# EAGLE design aaa_ME433_Beir_HW2 (EAGLE 5.12)
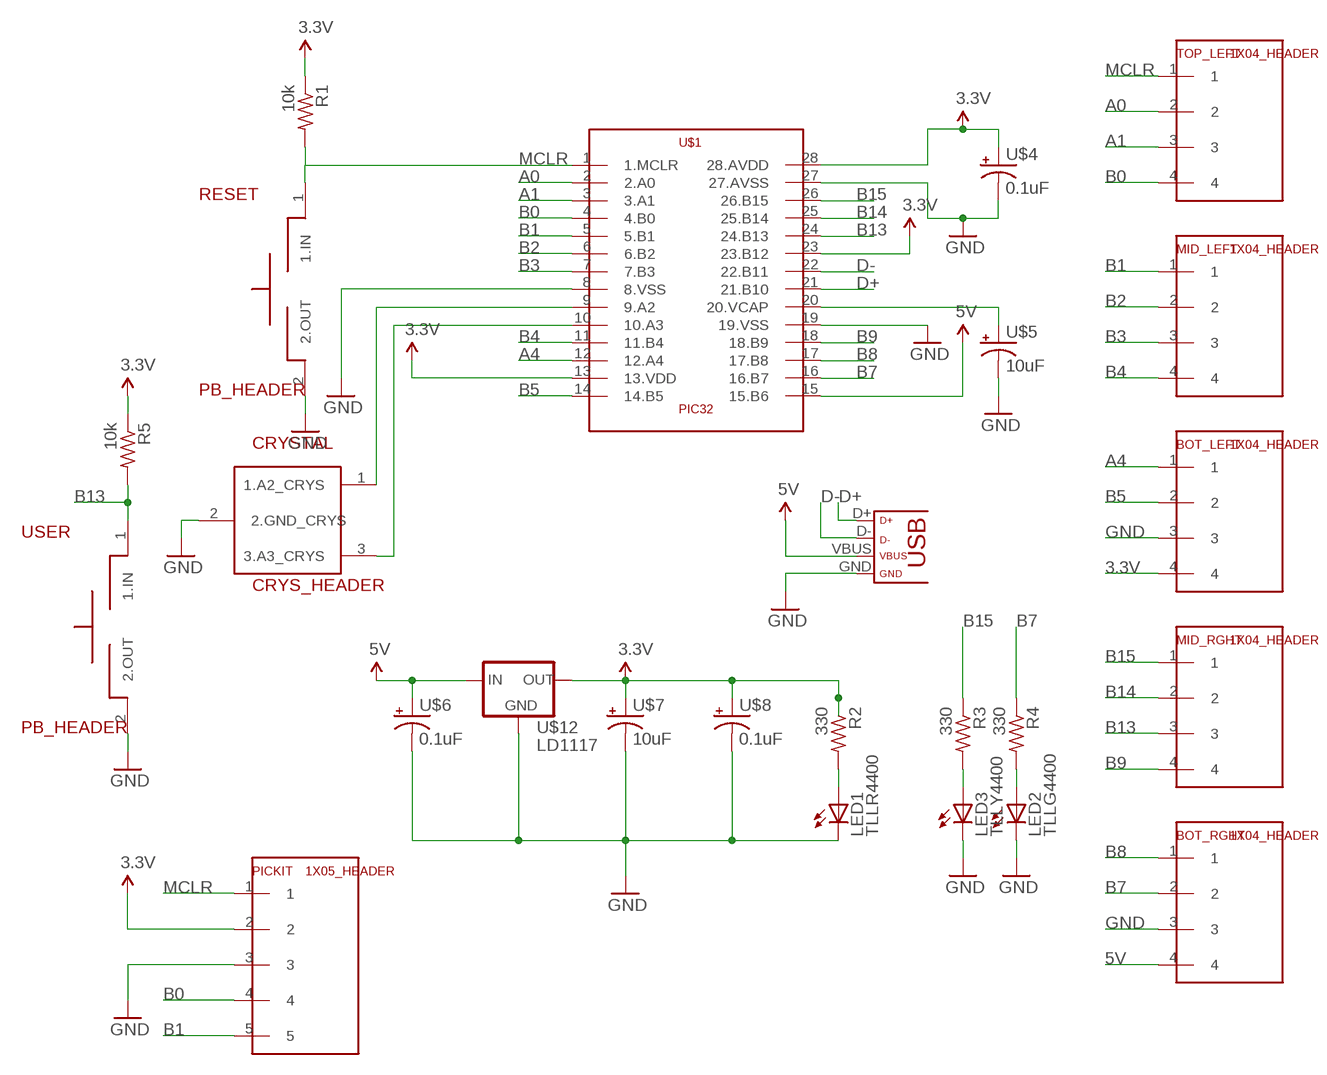
[diagram p0: schematic, sheet 1]

## Parts
BOT_LEFT  1X04_HEADER  [1X04]
BOT_RGHT  1X04_HEADER  [1X04]
CRYSTAL  CRYS_HEADER  [1X03]
LED1  TLLR4400  [LED3MM]
LED2  TLLG4400  [LED3MM]
LED3  TLLY4400  [LED3MM]
MID_LEFT  1X04_HEADER  [1X04]
MID_RGHT  1X04_HEADER  [1X04]
PICKIT  1X05_HEADER  [1X05]
R1  10k  R-US_0309/12  [0309/12]
R2  330  R-US_0309/12  [0309/12]
R3  330  R-US_0309/12  [0309/12]
R4  330  R-US_0309/12  [0309/12]
R5  10k  R-US_0309/12  [0309/12]
RESET  PB_HEADER  [1X02]
TOP_LEFT  1X04_HEADER  [1X04]
U$1  PIC32  [DIL28-3]
U$4  0.1uF  CAP_POL  [CAP_POL_D]
U$5  10uF  CAP_POL  [CAP_POL_D]
U$6  0.1uF  CAP_POL  [CAP_POL_D]
U$7  10uF  CAP_POL  [CAP_POL_D]
U$8  0.1uF  CAP_POL  [CAP_POL_D]
U$12  LD1117  [TO220]
U$13  USB  [USB-MINIB]
USER  PB_HEADER  [1X02]

## Nets
3.3V: BOT_LEFT.4 PICKIT.2 R1.1 R2.1 R5.1 U$1.13(13.VDD) U$1.23(23.B12) U$1.28(28.AVDD) U$4.1(+) U$7.1(+) U$8.1(+) U$12.2(OUT)
5V: BOT_RGHT.4 U$1.15(15.B6) U$6.1(+) U$12.3(IN) U$13.VBUS
A0: TOP_LEFT.2 U$1.2(2.A0)
A1: TOP_LEFT.3 U$1.3(3.A1)
A4: BOT_LEFT.1 U$1.12(12.A4)
B0: PICKIT.4 TOP_LEFT.4 U$1.4(4.B0)
B1: MID_LEFT.1 PICKIT.5 U$1.5(5.B1)
B2: MID_LEFT.2 U$1.6(6.B2)
B3: MID_LEFT.3 U$1.7(7.B3)
B4: MID_LEFT.4 U$1.11(11.B4)
B5: BOT_LEFT.2 U$1.14(14.B5)
B7: BOT_RGHT.2 R4.1 U$1.16(16.B7)
B8: BOT_RGHT.1 U$1.17(17.B8)
B9: MID_RGHT.4 U$1.18(18.B9)
B13: MID_RGHT.3 R5.2 U$1.24(24.B13) USER.1(1.IN)
B14: MID_RGHT.2 U$1.25(25.B14)
B15: MID_RGHT.1 R3.1 U$1.26(26.B15)
D+: U$1.21(21.B10) U$13.D+
D-: U$1.22(22.B11) U$13.D-
GND: BOT_LEFT.3 BOT_RGHT.3 CRYSTAL.2(2.GND_CRYS) LED1.K(C) LED2.K(C) LED3.K(C) PICKIT.3 RESET.2(2.OUT) U$1.8(8.VSS) U$1.19(19.VSS) U$1.27(27.AVSS) U$4.2(-) U$5.2(-) U$6.2(-) U$7.2(-) U$8.2(-) U$12.1(GND) U$13.GND USER.2(2.OUT)
MCLR: PICKIT.1 R1.2 RESET.1(1.IN) TOP_LEFT.1 U$1.1(1.MCLR)
N$2: CRYSTAL.3(3.A3_CRYS) U$1.10(10.A3)
N$3: CRYSTAL.1(1.A2_CRYS) U$1.9(9.A2)
N$4: U$1.20(20.VCAP) U$5.1(+)
N$6: LED1.A R2.2
N$32: LED3.A R3.2
N$33: LED2.A R4.2

## Library data of the parts
BOT_LEFT BOT_RGHT MID_LEFT MID_RGHT TOP_LEFT = ME433:1X04_HEADER
CRYSTAL = aaa_ME433_Beir_HW2:CRYS_HEADER
LED1 = aaa_ME433_Beir_HW2:TLLR4400: Low Current (2mA) LED 3 mm Tinted Diffused Package color RED Source: Data sheet <http://www.farnell.com/datasheets/391100.pdf>; MF: VISHAY SEMICONDUCTOR; OC_FARNELL: 1612437
LED2 = aaa_ME433_Beir_HW2:TLLG4400: Low Current (2mA) LED 3 mm Tinted Diffused Package color GREEN Source: Data sheet <http://www.farnell.com/datasheets/391098.pdf>; MF: VISHAY SEMICONDUCTOR; OC_FARNELL: 1612435
LED3 = aaa_ME433_Beir_HW2:TLLY4400: Low Current (2mA) LED 3 mm Tinted Diffused Package color YELLOW Source: Data sheet <http://www.farnell.com/datasheets/391098.pdf>; MF: VISHAY SEMICONDUCTOR; OC_FARNELL: 1612439
PICKIT = ME433:1X05_HEADER
R1-R5 = resistor:R-US_: RESISTOR, American symbol
RESET USER = aaa_ME433_Beir_HW2:PB_HEADER
U$1 = aaa_ME433_Beir_HW2:PIC32
U$4-U$8 = ME433:CAP_POL
U$12 = ME433:LD1117
U$13 = ME433:USB

## Board
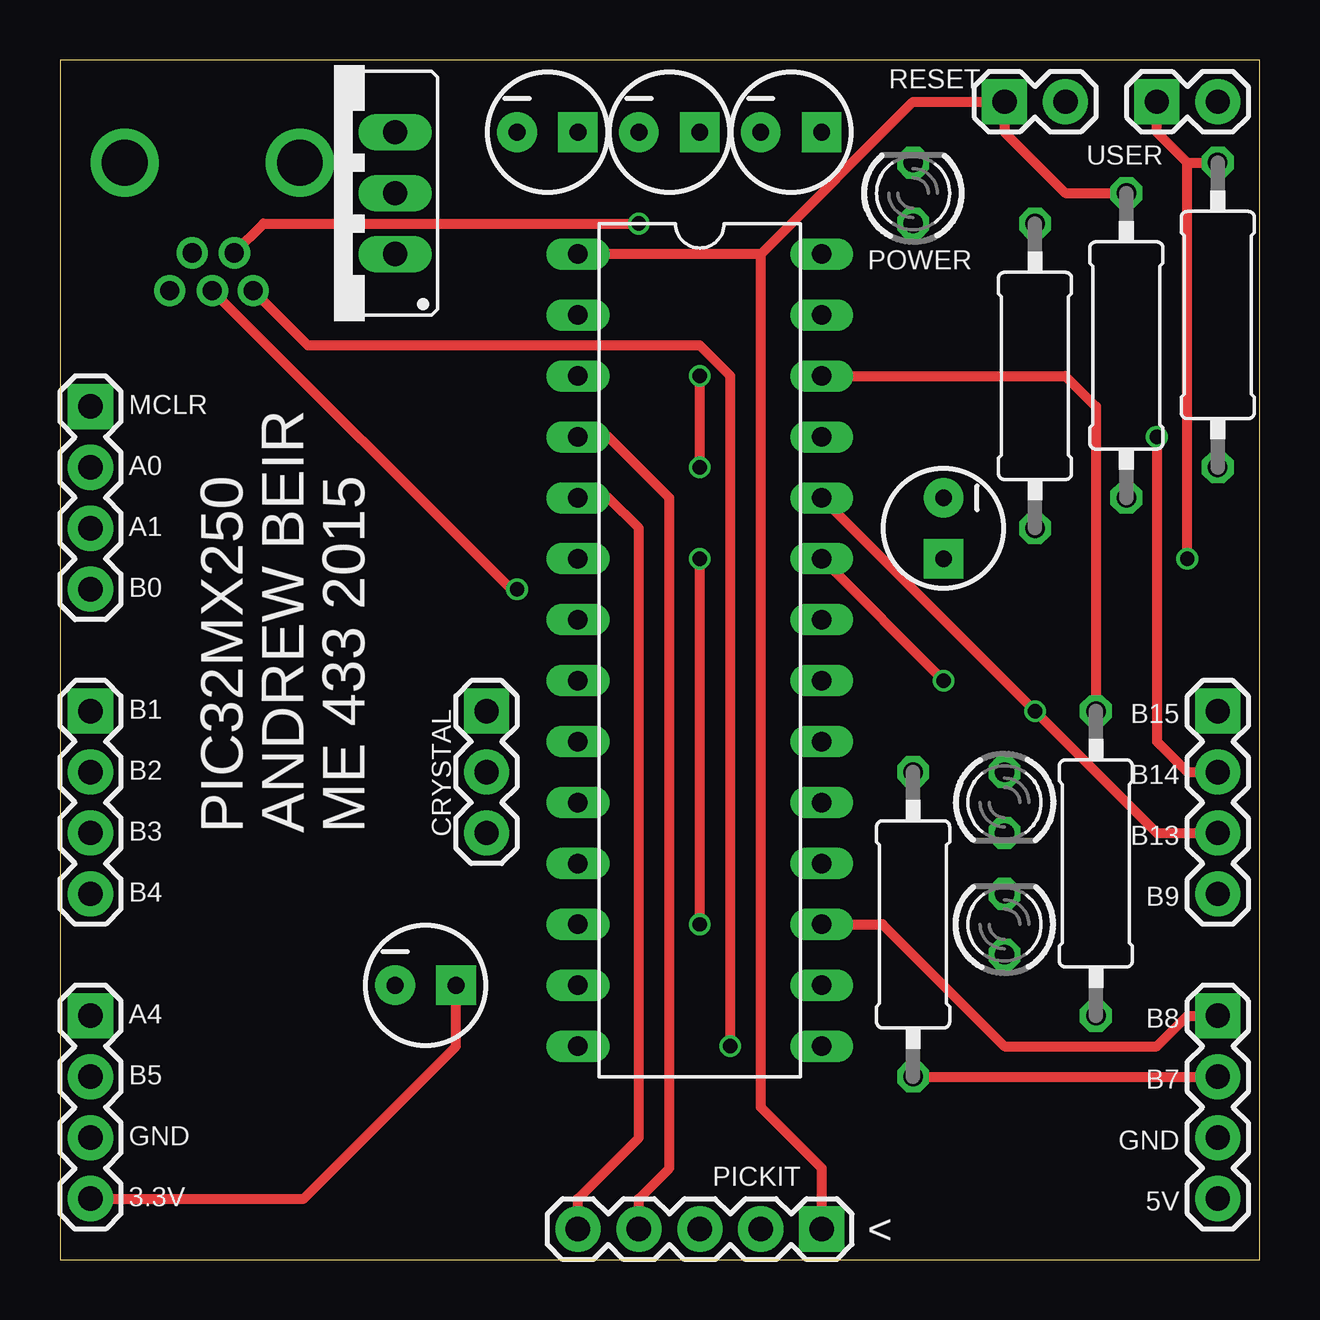
[diagram p1: board, top side]
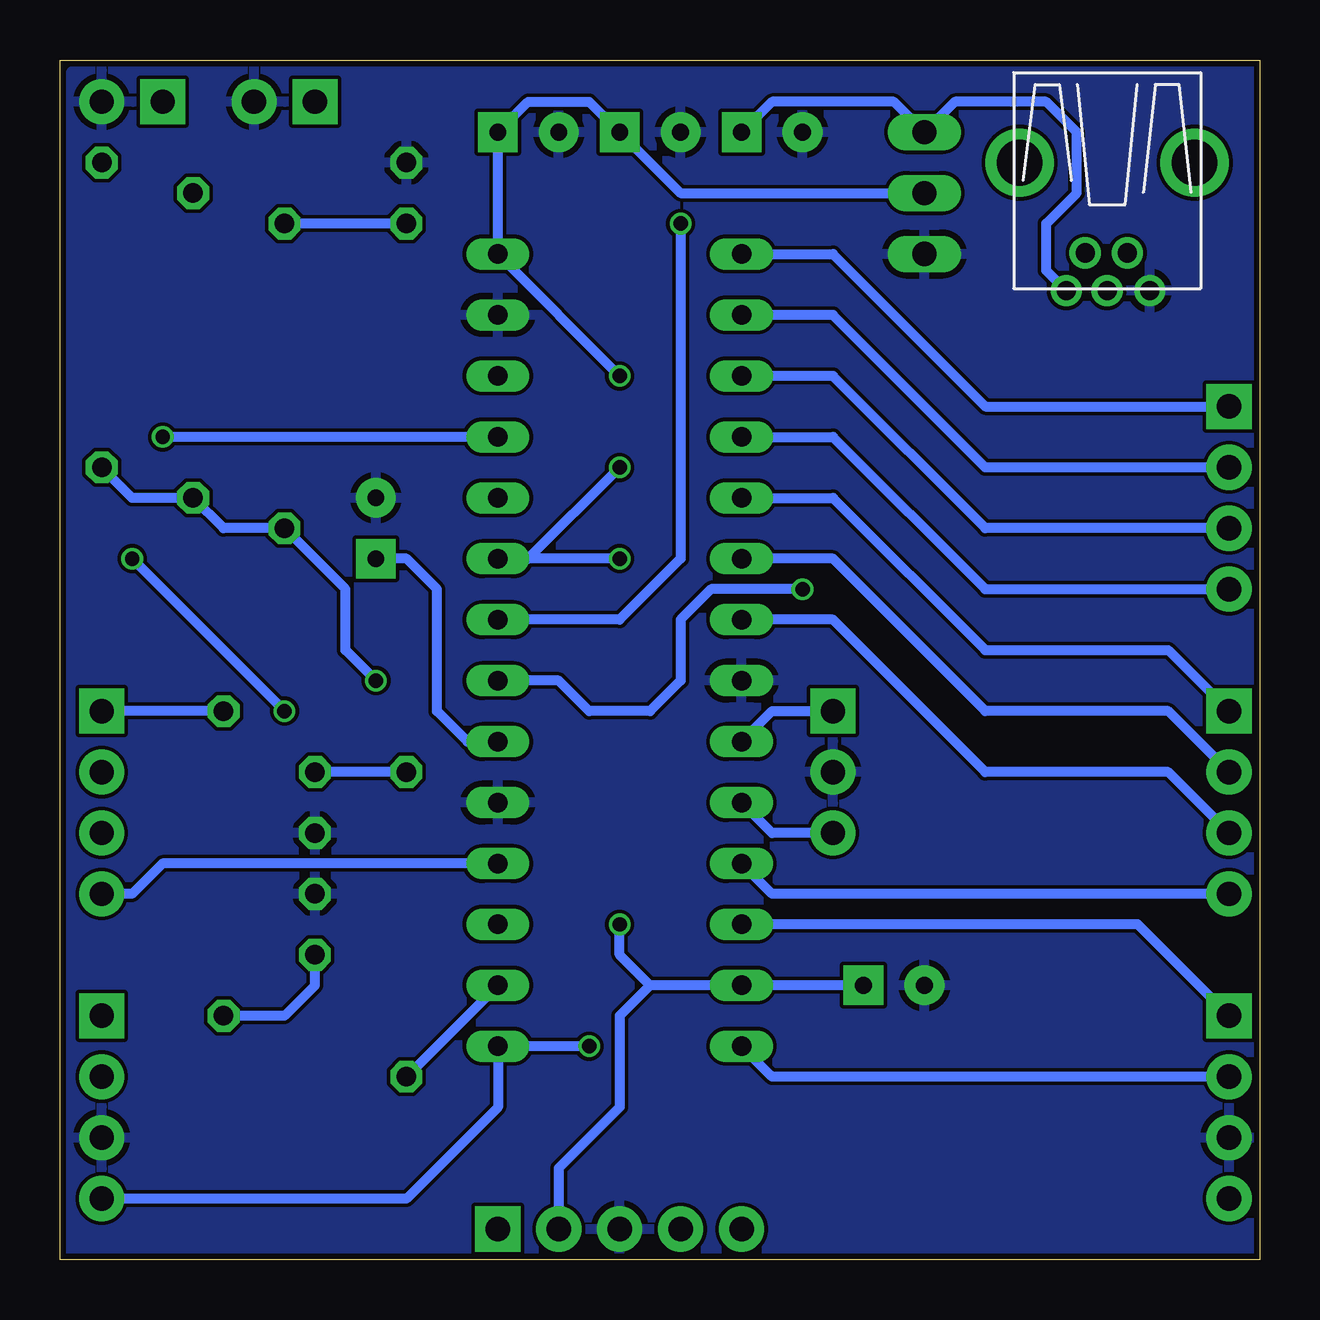
[diagram p2: board, bottom side, seen from below]

Size 50 x 50 mm. Coordinates in mm from the lower left corner, seen from the top.
Outline: 0,0 50,0 50,50 0,50 0,0
Copper layers (1*16): Top 0.035mm / dielectric 1.5mm / Bottom 0.035mm
Design rules "SeeedStudio_2layer_DRU_no_angle_20140221": minimum track width 6mil, minimum drill 12mil, track to track 6mil, track to pad 6mil, pad to pad 6mil, via to via 6mil, smd to smd 0mil, copper to edge 10mil, drill to drill 10mil, minimum pad ring 10mil, minimum via ring 6mil, stop-mask expansion 2mil, vias tented up to drill 100mil, thermal gap 10mil

### Footprints (pad centres in the part's own frame; a part is rotated, then mirrored left to right if it is on the bottom)
1X04 = drill 1.016 pad 1.88 square: 1 0,0 | drill 1.016 pad 1.88 round: 2 2.54,0; 3 5.08,0; 4 7.62,0
1X03 = drill 1.016 pad 1.88 square: 1 0,0 | drill 1.016 pad 1.88 round: 2 2.54,0; 3 5.08,0
LED3MM = drill 0.813 octagon: A -1.27,0; K 1.27,0
1X05 = drill 1.016 pad 1.88 square: 1 0,0 | drill 1.016 pad 1.88 round: 2 2.54,0; 3 5.08,0; 4 7.62,0; 5 10.16,0
0309/12 = drill 0.813 octagon: 1 -6.35,0; 2 6.35,0
1X02 = drill 1.016 pad 1.88 square: 1 0,0 | drill 1.016 pad 1.88 round: 2 2.54,0
DIL28-4 = drill 0.813 long: 1 -16.51,-5.08; 2 -13.97,-5.08; 3 -11.43,-5.08; 4 -8.89,-5.08; 5 -6.35,-5.08; 6 -3.81,-5.08; 7 -1.27,-5.08; 8 1.27,-5.08; 9 3.81,-5.08; 10 6.35,-5.08; 11 8.89,-5.08; 12 11.43,-5.08; 13 13.97,-5.08; 14 16.51,-5.08; 15 16.51,5.08; 16 13.97,5.08; 17 11.43,5.08; 18 8.89,5.08; 19 6.35,5.08; 20 3.81,5.08; 21 1.27,5.08; 22 -1.27,5.08; 23 -3.81,5.08; 24 -6.35,5.08; 25 -8.89,5.08; 26 -11.43,5.08; 27 -13.97,5.08; 28 -16.51,5.08
CAP_POL_D = drill 0.7 pad 1.651 square: 1 1.27,0 | drill 0.7 pad 1.651 round: 2 -1.27,0
TO220 = drill 1.016 long: 1 -2.54,0; 2 0,0; 3 2.54,0
USB-MINIB = drill 0.8 round: D+ 4.064,0; D- 2.489,0.914; GND 4.064,-1.778; ID 2.489,-0.838; VBUS 4.064,1.702 | drill 1.9 round: P$6 -1.27,-3.65; P$7 -1.27,3.65

### Placement (x,y rotation side)
BOT_LEFT  1.27,10.16 270 top
BOT_RGHT  48.26,10.16 270 top
CRYSTAL  17.78,22.86 270 top
LED1  35.56,44.45 90 top
LED2  39.37,19.05 270 top
LED3  39.37,13.97 90 top
MID_LEFT  1.27,22.86 270 top
MID_RGHT  48.26,22.86 270 top
PICKIT  31.75,1.27 180 top
R1  44.45,38.1 90 top
R2  40.64,36.83 90 top
R3  43.18,16.51 270 top
R4  35.56,13.97 90 top
R5  48.26,39.37 90 top
RESET  39.37,48.26 0 top
TOP_LEFT  1.27,35.56 270 top
U$1  PIC32  [DIL28-4]  26.67,25.4 270 top
U$4  15.24,11.43 0 top
U$5  36.83,30.48 270 top
U$6  20.32,46.99 0 top
U$7  25.4,46.99 0 top
U$8  30.48,46.99 0 top
U$12  13.97,44.45 90 top
U$13  6.35,44.45 270 top
USER  45.72,48.26 0 top

### Tracks (layer width: path | path; a pad name or v marks a point on that pad's centre or on a via)
3.3V  (via drill 0.6)
  Top 0.406: BOT_LEFT.4 10.16,2.54 16.51,8.89 U$4.1 | U$1.23 v36.83,24.13 | v26.67,33.02 v26.67,36.83 | v26.67,13.97 v26.67,29.21
  Bottom 0.406: U$12.2 24.13,44.45 U$7.1 27.94,48.26 30.48,48.26 U$8.1 U$1.28 v26.67,36.83 | R5.1 46.99,31.75 R1.1 43.18,30.48 R2.1 38.1,27.94 38.1,25.4 v36.83,24.13 | 30.48,29.21 v26.67,33.02 | 30.48,29.21 U$1.23 | 25.4,11.43 U$1.13 U$4.1 | 25.4,11.43 26.67,10.16 26.67,6.35 29.21,3.81 PICKIT.2 | 25.4,11.43 26.67,12.7 v26.67,13.97 | v26.67,29.21 30.48,29.21
5V  (via drill 0.6)
  Top 0.406: v27.94,8.89 27.94,36.83 26.67,38.1 10.34,38.1 U$13.VBUS
  Bottom 0.406: U$6.1 20.32,48.26 15.24,48.26 U$12.3 12.7,48.26 8.89,48.26 7.62,46.99 7.62,44.45 8.89,43.18 8.89,41.22 U$13.VBUS | BOT_RGHT.4 35.56,2.54 31.75,6.35 U$1.15 v27.94,8.89
A0
  Bottom 0.406: TOP_LEFT.2 11.43,33.02 17.78,39.37 U$1.2
A1
  Bottom 0.406: TOP_LEFT.3 11.43,30.48 17.78,36.83 U$1.3
A4
  Bottom 0.406: U$1.12 5.08,13.97 BOT_LEFT.1
B0
  Top 0.406: PICKIT.4 24.13,2.54 25.4,3.81 25.4,31.75 22.86,34.29 U$1.4
  Bottom 0.406: TOP_LEFT.4 11.43,27.94 17.78,34.29 U$1.4
B1
  Top 0.406: PICKIT.5 21.59,2.54 24.13,5.08 24.13,30.48 22.86,31.75 U$1.5
  Bottom 0.406: MID_LEFT.1 3.81,25.4 11.43,25.4 17.78,31.75 U$1.5
B2
  Bottom 0.406: MID_LEFT.2 3.81,22.86 11.43,22.86 17.78,29.21 U$1.6
B3
  Bottom 0.406: MID_LEFT.3 3.81,20.32 11.43,20.32 17.78,26.67 U$1.7
B4
  Bottom 0.406: MID_LEFT.4 20.32,15.24 U$1.11
B5
  Bottom 0.406: BOT_LEFT.2 20.32,7.62 U$1.14
B7
  Top 0.406: R4.1 BOT_RGHT.2
  Bottom 0.406: U$1.16 R4.1
B8
  Top 0.406: U$1.17 34.29,13.97 39.37,8.89 45.72,8.89 46.99,10.16 BOT_RGHT.1
B9
  Bottom 0.406: U$1.18 45.72,16.51 46.99,15.24 MID_RGHT.4
B13  (via drill 0.6)
  Top 0.406: USER.1 45.72,46.99 46.99,45.72 | 46.99,45.72 R5.2 | v46.99,29.21 46.99,45.72 | U$1.24 v40.64,22.86 45.72,17.78 MID_RGHT.3
  Bottom 0.406: v40.64,22.86 v46.99,29.21
B14  (via drill 0.6)
  Top 0.406: v45.72,34.29 45.72,21.59 46.99,20.32 MID_RGHT.2
  Bottom 0.406: U$1.25 v45.72,34.29
B15
  Top 0.406: U$1.26 41.91,36.83 43.18,35.56 R3.1
  Bottom 0.406: R3.1 MID_RGHT.1
D+  (via drill 0.6)
  Top 0.406: v19.05,27.94 18.8,27.94 U$13.D+
  Bottom 0.406: U$1.21 29.21,24.13 27.94,22.86 25.4,22.86 24.13,24.13 24.13,26.67 22.86,27.94 v19.05,27.94
D-  (via drill 0.6)
  Top 0.406: v24.13,43.18 8.48,43.18 U$13.D-
  Bottom 0.406: U$1.22 26.67,26.67 24.13,29.21 v24.13,43.18
GND
  pour Bottom: 0,49.53 0,0 49.53,0 49.53,49.53
MCLR
  Top 0.406: PICKIT.1 31.75,3.81 29.21,6.35 29.21,41.91 | R1.2 41.91,44.45 39.37,46.99 RESET.1 35.56,48.26 29.21,41.91 | 29.21,41.91 U$1.1
  Bottom 0.406: TOP_LEFT.1 11.43,35.56 17.78,41.91 U$1.1
N$2
  Bottom 0.406: CRYSTAL.3 20.32,17.78 U$1.10
N$3
  Bottom 0.406: CRYSTAL.1 20.32,22.86 U$1.9
N$4
  Bottom 0.406: U$1.20 33.02,21.59 34.29,22.86 34.29,27.94 35.56,29.21 U$5.1
N$6
  Bottom 0.406: LED1.A R2.2
N$32
  Bottom 0.406: R3.2 40.64,10.16 39.37,11.43 LED3.A
N$33
  Bottom 0.406: R4.2 LED2.A

### Text on the board
tPlace: POWER | MCLR | A0 | A1 | B0 | B1 | B15 | B14 | B2 | PIC32MX250 | ANDREW BEIR | ME 433 2015 | B13 | B3 | B9 | B4 | A4 | B8 | B7 | B5 | GND | GND | 5V | 3.3V | <